# Altium schematic sheet GPIO.SchDoc
size B; DocumentNumber: 8; SheetNumber: 8
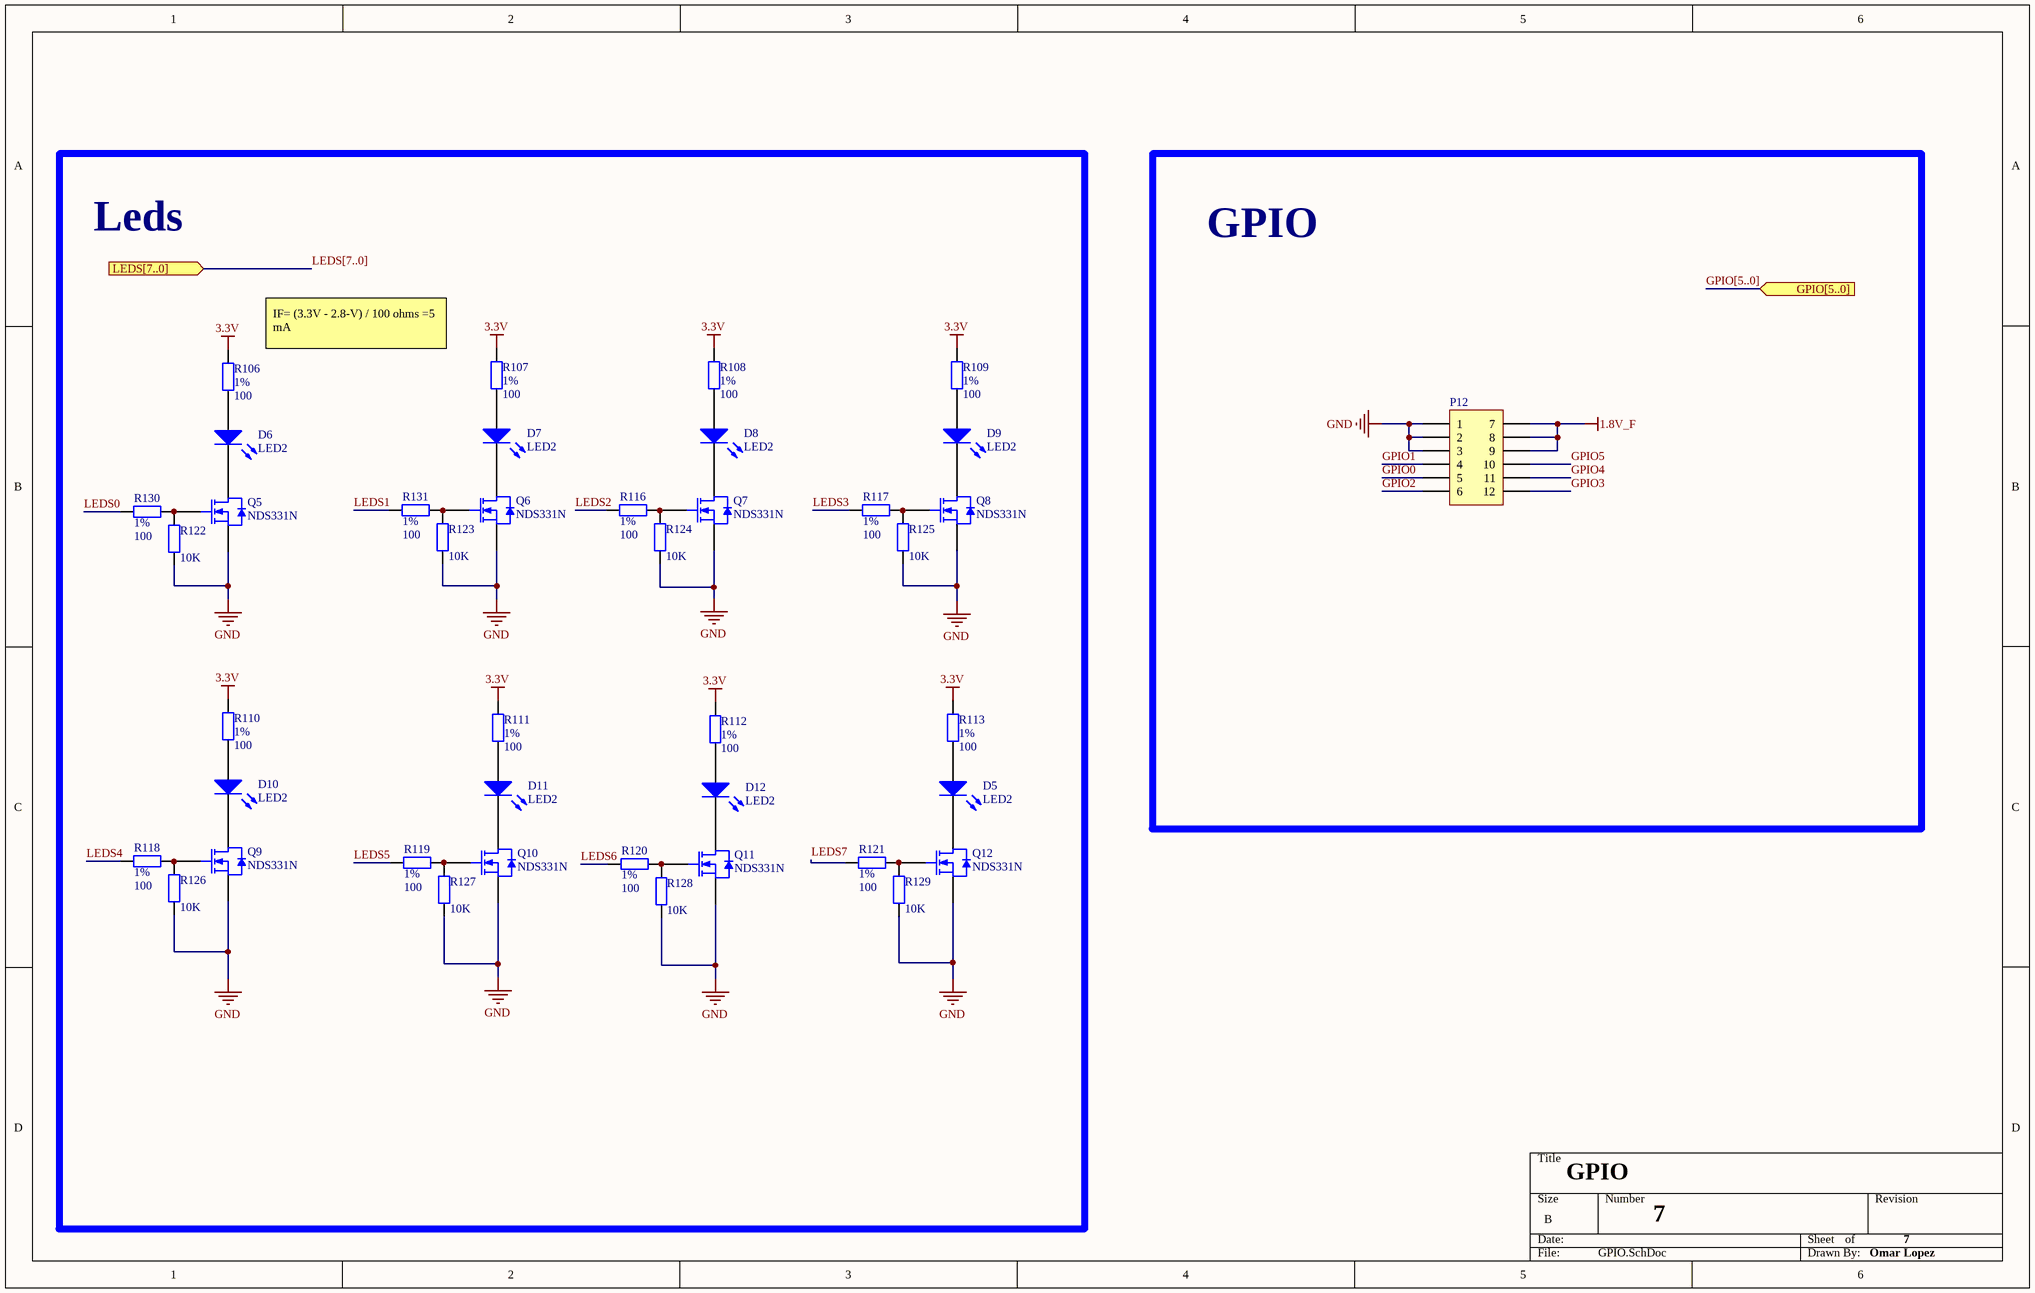
[diagram p0: GPIO.SchDoc]

## Parts
D5  LED2  [LTSTC191]
D6  LED2  [LTSTC191]
D7  LED2  [LTSTC191]
D8  LED2  [LTSTC191]
D9  LED2  [LTSTC191]
D10  LED2  [LTSTC191]
D11  LED2  [LTSTC191]
D12  LED2  [LTSTC191]
P12  (no value)  [PPTC062LJBN-RC]
Q5  NDS331N  [ON_Semi_527AG-01_0]
Q6  NDS331N  [ON_Semi_527AG-01_0]
Q7  NDS331N  [ON_Semi_527AG-01_0]
Q8  NDS331N  [ON_Semi_527AG-01_0]
Q9  NDS331N  [ON_Semi_527AG-01_0]
Q10  NDS331N  [ON_Semi_527AG-01_0]
Q11  NDS331N  [ON_Semi_527AG-01_0]
Q12  NDS331N  [ON_Semi_527AG-01_0]
R106  1%  value 100  [RC0402N]
R107  1%  value 100  [RC0402N]
R108  1%  value 100  [RC0402N]
R109  1%  value 100  [RC0402N]
R110  1%  value 100  [RC0402N]
R111  1%  value 100  [RC0402N]
R112  1%  value 100  [RC0402N]
R113  1%  value 100  [RC0402N]
R116  1%  value 100  [RC0402N]
R117  1%  value 100  [RC0402N]
R118  1%  value 100  [RC0402N]
R119  1%  value 100  [RC0402N]
R120  1%  value 100  [RC0402N]
R121  1%  value 100  [RC0402N]
R122  value 10K  [RC0402N]
R123  value 10K  [RC0402N]
R124  value 10K  [RC0402N]
R125  value 10K  [RC0402N]
R126  value 10K  [RC0402N]
R127  value 10K  [RC0402N]
R128  value 10K  [RC0402N]
R129  value 10K  [RC0402N]
R130  1%  value 100  [RC0402N]
R131  1%  value 100  [RC0402N]

## Blocks framed on the sheet
Leds: D5-D12 Q5-Q12 R106-R113 R116-R131
GPIO: P12

## Ports
GPIO[5..0] (in), LEDS[7..0] (in)

## Nets
1.8V_F: P12.7 P12.8 P12.9
3.3V: R106.2 R107.2 R108.2 R109.2 R110.2 R111.2 R112.2 R113.2
GND: P12.1 P12.2 P12.3 Q5.3(S) Q6.3(S) Q7.3(S) Q8.3(S) Q9.3(S) Q10.3(S) Q11.3(S) Q12.3(S) R122.2 R123.2 R124.2 R125.2 R126.2 R127.2 R128.2 R129.2
GPIO0: P12.5
GPIO1: P12.4
GPIO2: P12.6
GPIO3: P12.12
GPIO4: P12.11
GPIO5: P12.10
LEDS0: R130.2
LEDS1: R131.2
LEDS2: R116.2
LEDS3: R117.2
LEDS4: R118.2
LEDS5: R119.2
LEDS6: R120.2
LEDS7: R121.2
NetD5_1: D5.1(A) R113.1
NetD5_2: D5.2(K) Q12.2(D)
NetD6_1: D6.1(A) R106.1
NetD6_2: D6.2(K) Q5.2(D)
NetD7_1: D7.1(A) R107.1
NetD7_2: D7.2(K) Q6.2(D)
NetD8_1: D8.1(A) R108.1
NetD8_2: D8.2(K) Q7.2(D)
NetD9_1: D9.1(A) R109.1
NetD9_2: D9.2(K) Q8.2(D)
NetD10_1: D10.1(A) R110.1
NetD10_2: D10.2(K) Q9.2(D)
NetD11_1: D11.1(A) R111.1
NetD11_2: D11.2(K) Q10.2(D)
NetD12_1: D12.1(A) R112.1
NetD12_2: D12.2(K) Q11.2(D)
NetQ5_1: Q5.1(G) R122.1 R130.1
NetQ6_1: Q6.1(G) R123.1 R131.1
NetQ7_1: Q7.1(G) R116.1 R124.1
NetQ8_1: Q8.1(G) R117.1 R125.1
NetQ9_1: Q9.1(G) R118.1 R126.1
NetQ10_1: Q10.1(G) R119.1 R127.1
NetQ11_1: Q11.1(G) R120.1 R128.1
NetQ12_1: Q12.1(G) R121.1 R129.1

## Buses and harness runs
bus GPIO[5..0] = port GPIO[5..0]
bus LEDS[7..0] = port LEDS[7..0]

## Notes on the sheet
- IF= (3.3V - 2.8-V) / 100 ohms =5 mA
- GPIO
- 7
- Omar Lopez

## Library data of the parts
D5-D12 = LED2: Typical RED, GREEN, YELLOW, AMBER GaAs LED; Manufacturer: Panasonic; PartNumber: LTST-C193TGKT-5A; Descripción: LED estándar - SMD (montaje superficial) LED RED RECT; CostoVendedor1: 0.28; Vendedor1: Mouser; Vendedor2: Digi-Key; DataSheet: http://www.mouser.com/ds/2/315/LNJ247W82RA_E-947457.pdf; Package: 0603; LinkVendedor1: https://ar.mouser.com/ProductDetail/Lite-On/LTST-C193TGKT-5A?qs=sGAEpiMZZMseGfSY3csMkTQVMbQ3YFstHskAr8LAtWI%3d; Stock1: 29700
P12 = Header 6X2A: Header, 6-Pin, Dual row; Manufacturer: Sullins Connector Solutions; CostoVendedor1: 1.23; Descripción: CONN FEMALE 12POS DL .1" R/A TIN; Vendedor1: Digi-Key; Vendedor2: Mouser; DataSheet: http://sullinscorp.com/drawings/101_P(N)PxCxx2LJBN-RC,_10494-H.pdf; LinkVendedor2: https://www.digikey.com/product-detail/en/sullins-connector-solutions/PPTC062LJBN-RC/S5520-ND/775978; PartNumber: PPTC062LJBN-RC; Stock2: 2290
Q5-Q12 = SUP70N06-14: N-Channel 60V (D-S), 175'C  MOSFET; Manufacturer: On Semiconductor; Descripción: MOSFET N-Ch Digital; CostoVendedor1: 0.35; CostoVendedor2: 0.44; Vendedor1: Mouser; Vendedor2: Digi-Key; DataSheet: https://ar.mouser.com/datasheet/2/308/NDS331N-1125222.pdf; Package: SOT23; PartNumber: NDS331N; LinkVendedor1: https://ar.mouser.com/ProductDetail/ON-Semiconductor-Fairchild/NDS331N?qs=%2Fha2pyFaduhqNlXqKbr%252BjEIU%252BqNoYpa937WlNrMOk8Sienkx2gIkoQ%3D%3D&utm_source=octopart&utm_medium=aggregator&utm_campaign=512-NDS331N&utm_content=ON%20Semiconductor; LinkVendedor2: https://www.digikey.com/product-detail/es/NDS331N/NDS331NCT-ND/458997?utm_campaign=buynow&WT.z_cid=ref_octopart_dkc_buynow&utm_medium=aggregator&curr=usd&site=us&utm_source=octopart; Stock1: 340000; Stock2: 135000
R106-R113 R116-R121 R130 R131 = Res2: Resistor; Manufacturer: Panasonic; PartNumber: ERJ-2RKF4701X; Descripción: Anti-Sulfur  100 mW 50V; CostoVendedor1: 0.021; Vendedor1: Mouser; Vendedor2: Digi-Key; Package: 0402; Tolerance: 1%; DataSheet: http://www.mouser.com/ds/2/315/AOA0000C104-947597.pdf; LinkVendedor1: https://ar.mouser.com/ProductDetail/Panasonic-Industrial-Devices/ERJ-2RKF1000X?qs=sGAEpiMZZMu61qfTUdNhGzxKJJelZRhEGST%2fbP4fbIc%3d; Stock1: 1000000
R122-R129 = Res2: Resistor; Manufacturer: Panasonic; PartNumber: ERJ-2RKF1002X; Tolerance: 1%; Descripción: 100mW 50V; CostoVendedor1: 0.021; Vendedor1: Mouser; Vendedor2: Digi-Key; Package: 0402; DataSheet: http://www.mouser.com/ds/2/315/AOA0000C86-911473.pdf; LinkVendedor1: https://ar.mouser.com/ProductDetail/Panasonic-Industrial-Devices/ERJ-2RKF1002X?qs=%2fha2pyFadujciewGcSbxYCeocmJ1V0ffuiBNpRUU2nm5e2XaRJ685Q%3d%3d; Stock1: 2000000